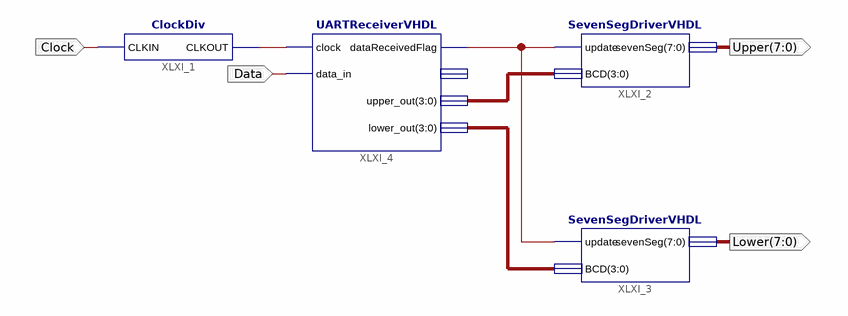
[diagram p0: schematic sheet 1]
// Xilinx ISE schematic TopLevelSchematic.sch (xbr) as structural Verilog: 4 symbols, 4 ports
module TopLevelSchematic (
  input  Clock,
  input  Data,
  output [7:0] Lower,
  output [7:0] Upper
);

  wire XLXN_1, XLXN_25;
  wire [3:0] XLXN_26, XLXN_27;

  ClockDiv XLXI_1 (.CLKIN(Clock), .CLKOUT(XLXN_1));
  SevenSegDriverVHDL XLXI_3 (.update(XLXN_25), .BCD(XLXN_27), .sevenSeg(Lower));
  SevenSegDriverVHDL XLXI_2 (.update(XLXN_25), .BCD(XLXN_26), .sevenSeg(Upper));
  UARTReceiverVHDL XLXI_4 (
    .clock(XLXN_1), .data_in(Data), .dataReceivedFlag(XLXN_25), .upper_out(XLXN_26), .lower_out(XLXN_27));  // open: data_out
endmodule
